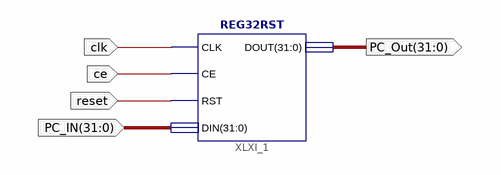
[diagram p0: schematic sheet 1]
// Xilinx ISE schematic REG_PC.sch (spartan6) as structural Verilog: 1 symbols, 5 ports
module REG_PC (
  input  clk,
  input  ce,
  input  reset,
  input  [31:0] PC_IN,
  output [31:0] PC_Out
);

  REG32RST XLXI_1 (.CLK(clk), .CE(ce), .RST(reset), .DIN(PC_IN), .DOUT(PC_Out));
endmodule
